# EAGLE design non_inverting_amplifier (EAGLE 9.3.2)
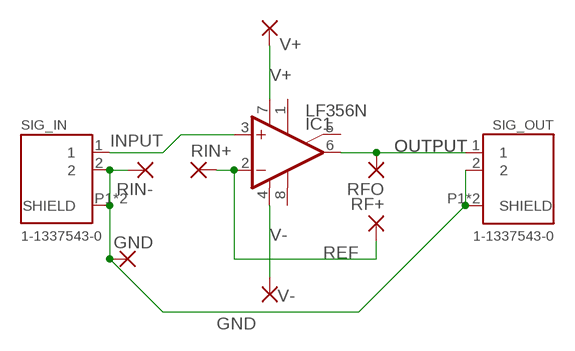
[diagram p0: schematic, sheet 1]

## Parts
GND  2,54/1,1  [2,54/1,1]
IC1  LF356N  [DIL08]
RF+  2,54/1,1  [2,54/1,1]
RFO  2,54/1,1  [2,54/1,1]
RIN+  2,54/1,1  [2,54/1,1]
RIN-  2,54/1,1  [2,54/1,1]
SIG_IN  1-1337543-0  [CONN_1-1337543-0]
SIG_OUT  1-1337543-0  [CONN_1-1337543-0]
V+  2,54/1,1  [2,54/1,1]
V-  2,54/1,1  [2,54/1,1]

## Nets
GND: GND.1(P) RIN-.1(P) SIG_IN.2 SIG_IN.P1(SHIELD) SIG_IN.P2(SHIELD) SIG_OUT.2 SIG_OUT.P1(SHIELD) SIG_OUT.P2(SHIELD)
INPUT: IC1.3(+IN) SIG_IN.1
OUTPUT: IC1.6(OUT) RFO.1(P) SIG_OUT.1
REF: IC1.2(-IN) RF+.1(P) RIN+.1(P)
V+: IC1.7(V+) V+.1(P)
V-: IC1.4(V-) V-.1(P)
Unconnected: IC1.1(ON1) IC1.5(ON2) IC1.8(OPT)

## Library data of the parts
GND RF+ RFO RIN+ RIN- V+ V- = wirepad:2,54/1,1: THROUGH-HOLE PAD
IC1 = linear:LF356: OP AMP
SIG_IN SIG_OUT = jayich_lab_eagle_library:1-1337543-0: BNC appliance socket, right angle [TE Connectivity] 1-1337543-0 BNC appliance socket, right angle; COMMENT: 1-1337543-0; DESCRIPTION: BNC Ins R/A PCB Skt 50Ohm White; DIGI-KEY_PART_NUMBER: A97553-ND; DIGI-KEY_PURCHASE_URL: https://www.digikey.com/product-detail/en/te-connectivity-amp-connectors/1-1337543-0/A97553-ND/1755940?utm_source=snapeda&utm_medium=aggregator&utm_campaign=symbol; MF: TE Connectivity; MP: 1-1337543-0; NUMBER_OF_POSITIONS: 1; PACKAGE: None; TE_PURCHASE_URL: https://www.te.com/usa-en/product-1-1337543-0.html?te_bu=Cor&te_type=disp&te_campaign=seda_glo_cor-seda-global-disp-prtnr-fy19-seda-model-bom-cta_sma-317_1&elqCampaignId=32493

## Board
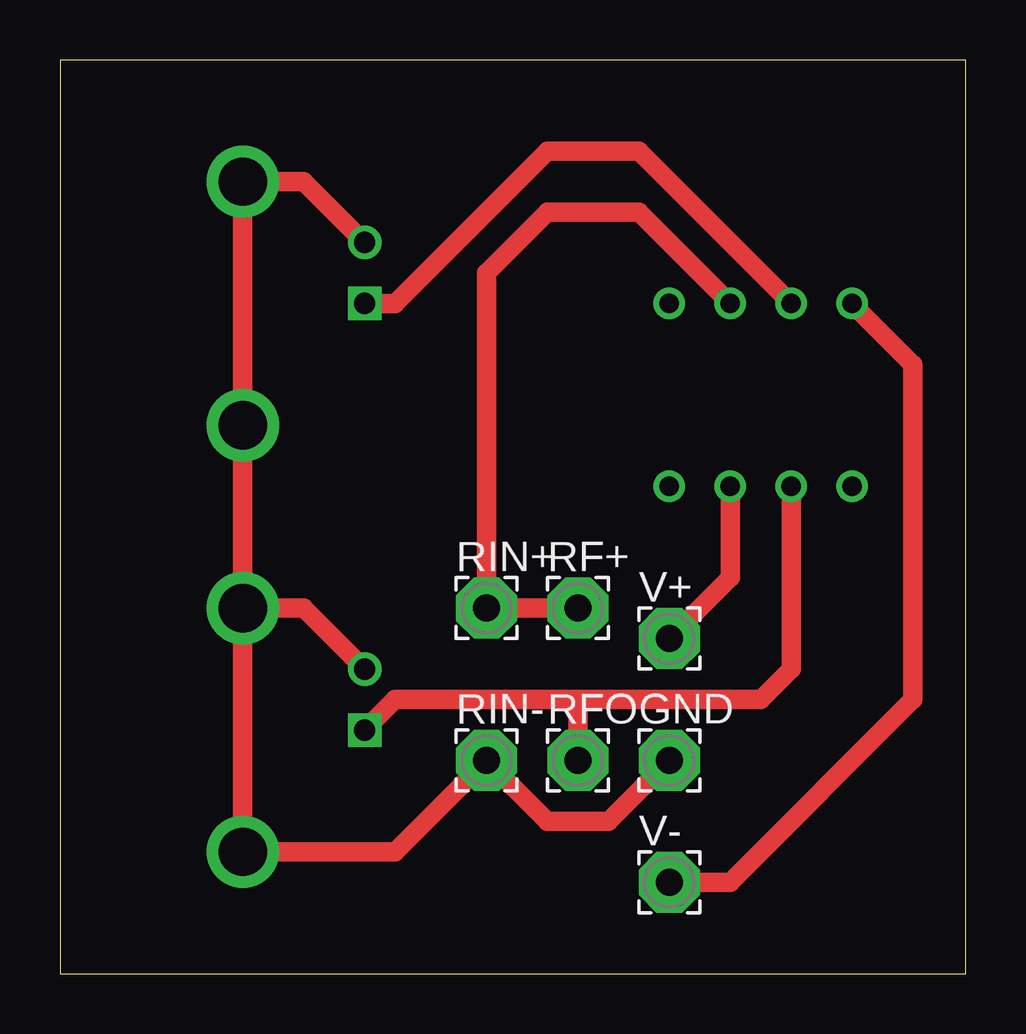
[diagram p1: board, top side]
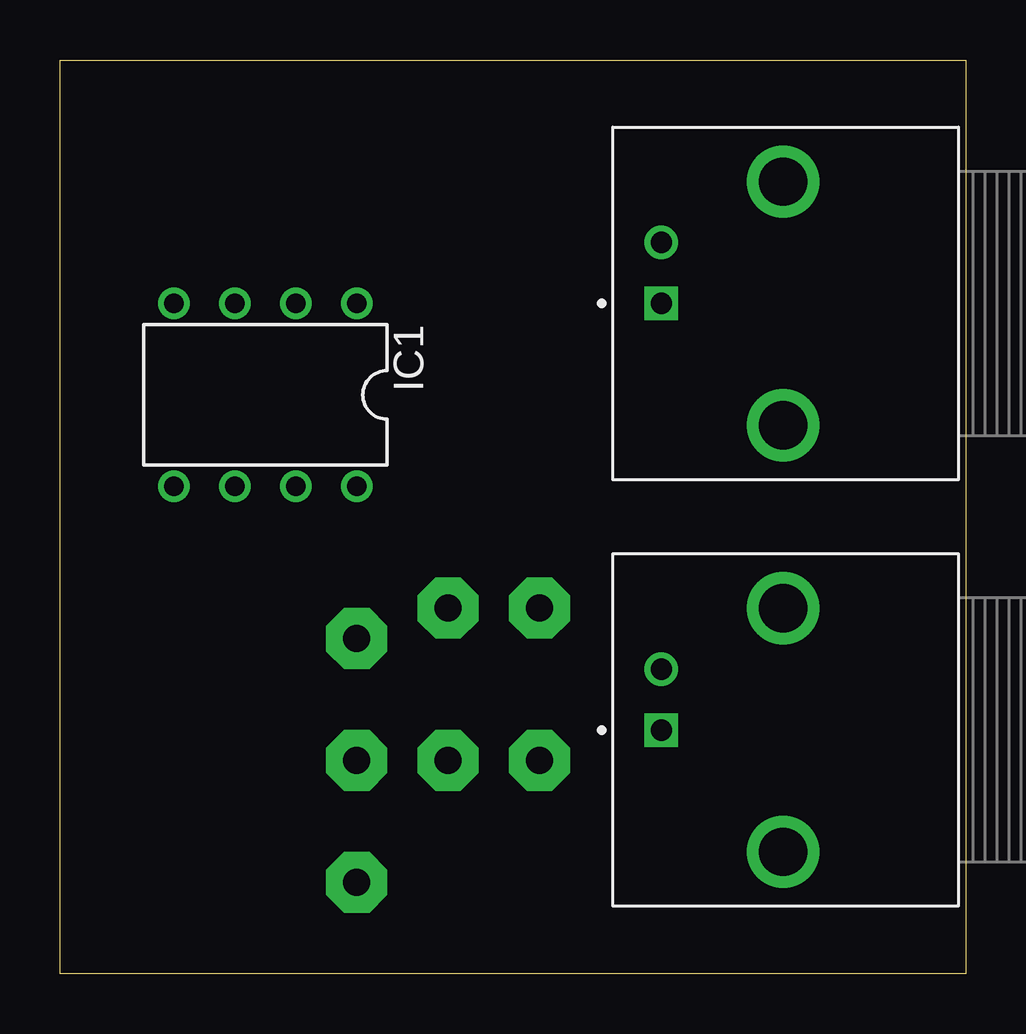
[diagram p2: board, bottom side, seen from below]

Size 37.77 x 38.09 mm. Coordinates in mm from the lower left corner, seen from the top.
Outline: 0,0 37.77,0 37.77,38.09 0,38.09 0,0
Copper layers (1*16): Top 0.035mm / dielectric 1.5mm / Bottom 0.035mm
Design rules "default": minimum track width 6mil, minimum drill 0.35mm, track to track 6mil, track to pad 6mil, pad to pad 6mil, via to via 6mil, smd to smd 6mil, copper to edge 40mil, drill to drill 6mil, minimum pad ring 10mil, minimum via ring 8mil, stop-mask expansion 4mil, vias tented up to drill 0mil, thermal gap 10mil

### Footprints (pad centres in the part's own frame; a part is rotated, then mirrored left to right if it is on the bottom)
2,54/1,1 = drill 1.118 pad 2.54 octagon: 1 0,0
DIL08 = drill 0.813 pad 1.27: 1 -3.81,-3.81; 2 -1.27,-3.81; 3 1.27,-3.81; 4 3.81,-3.81; 5 3.81,3.81; 6 1.27,3.81; 7 -1.27,3.81; 8 -3.81,3.81
CONN_1-1337543-0 = drill 0.89 square: 1 0,0 | drill 0.89: 2 0,-2.54 | drill 2.01: P1 -5.08,-5.08; P2 -5.08,5.08

### Placement (x,y rotation side)
GND  25.4,8.89 0 top
IC1  29.21,24.13 180 bottom
RF+  21.59,15.24 0 top
RFO  21.59,8.89 0 top
RIN+  17.78,15.24 0 top
RIN-  17.78,8.89 0 top
SIG_IN  12.7,27.94 180 bottom
SIG_OUT  12.7,10.16 180 bottom
V+  25.4,13.97 180 top
V-  25.4,3.81 0 top

### Tracks (layer width: path | path; a pad name or v marks a point on that pad's centre or on a via)
GND
  Top 0.813: SIG_IN.2 10.16,33.02 SIG_IN.P1 SIG_IN.P2 SIG_OUT.P1 | SIG_OUT.P1 SIG_OUT.P2 13.97,5.08 RIN-.1 20.32,6.35 22.86,6.35 GND.1 | SIG_OUT.2 10.16,15.24 SIG_OUT.P1
INPUT
  Top 0.813: SIG_IN.1 13.97,27.94 20.32,34.29 24.13,34.29 IC1.3
OUTPUT
  Top 0.813: 21.59,11.43 13.97,11.43 SIG_OUT.1 | 21.59,11.43 29.21,11.43 30.48,12.7 IC1.6 | RFO.1 21.59,11.43
REF
  Top 0.813: IC1.2 24.13,31.75 20.32,31.75 17.78,29.21 RIN+.1 RF+.1
V+
  Top 0.813: IC1.7 27.94,16.51 V+.1
V-
  Top 0.813: IC1.4 35.56,25.4 35.56,11.43 27.94,3.81 V-.1